# EAGLE design Xbee_Adapter (EAGLE 7.6.0)
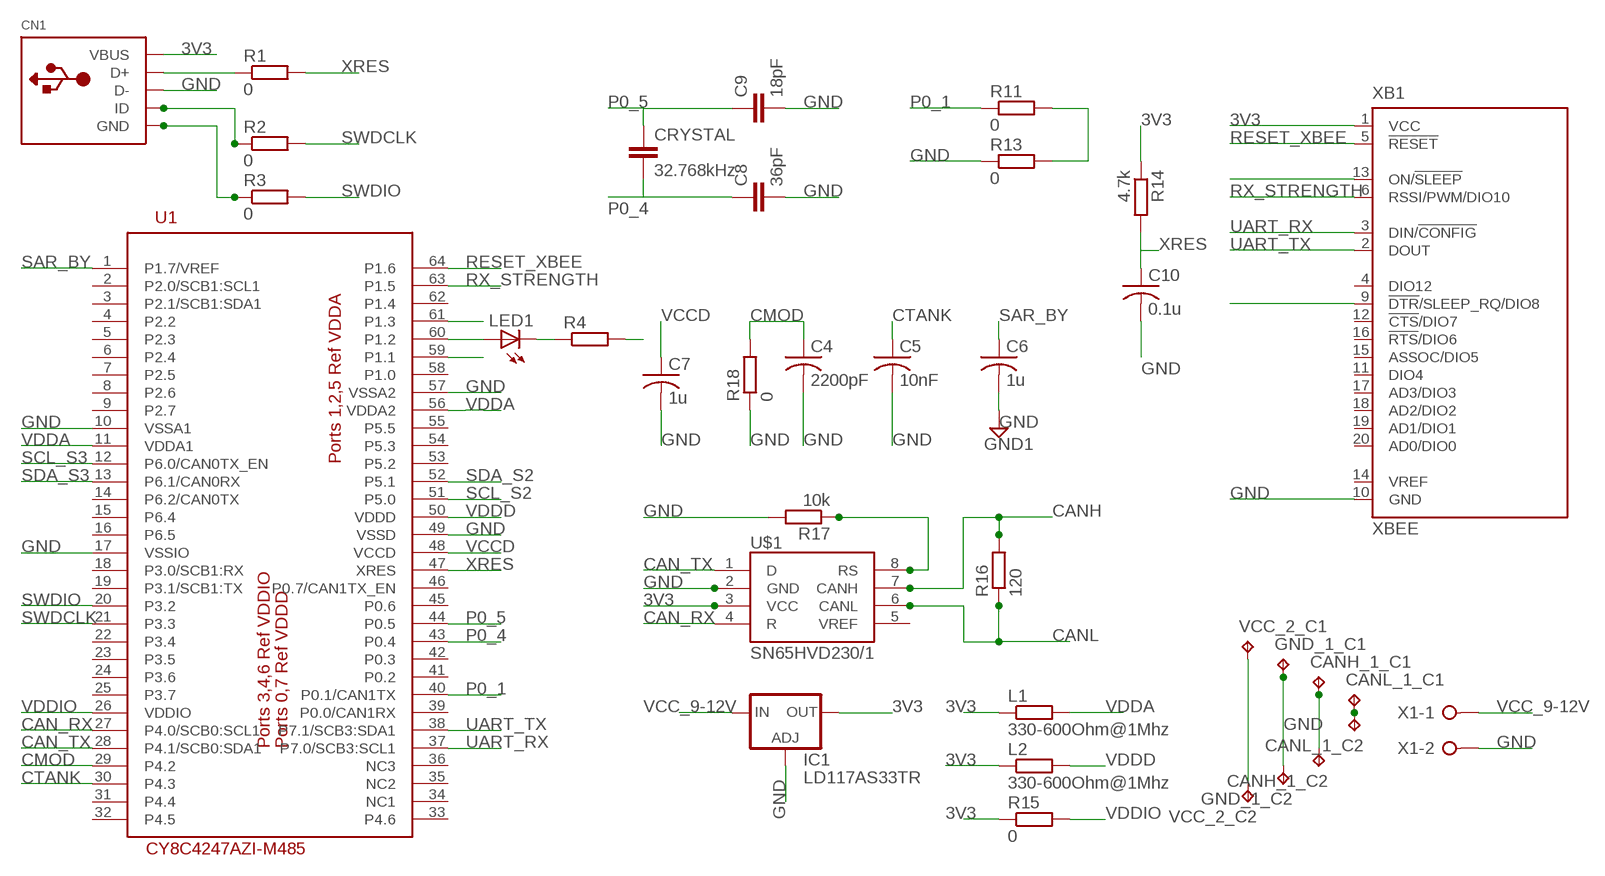
[diagram p0: schematic, sheet 1]

## Parts
C4  2200pF  C-USC0805  [C0805]
C5  10nF  C-USC0805  [C0805]
C6  1u  C-USC0805  [C0805]
C7  1u  C-USC0805  [C0805]
C8  36pF  C-EUC0805  [C0805]
C9  18pF  C-EUC0805  [C0805]
C10  0.1u  C-USC0805  [C0805]
CANH_1_C1  TPB2,54  [B2,54]
CANH_1_C2  TPB2,54  [B2,54]
CANL_1_C1  TPB2,54  [B2,54]
CANL_1_C2  TPB2,54  [B2,54]
CN1  USBMINIB  [USB-MINIB]
CRYSTAL  32.768kHz  C-EUC0603  [C0603]
GND_1_C1  TPB2,54  [B2,54]
GND_1_C2  TPB2,54  [B2,54]
IC1  LD117AS33TR  [SOT223]
L1  330-600Ohm@1Mhz  R-EU_R0805  [R0805]
L2  330-600Ohm@1Mhz  R-EU_R0805  [R0805]
LED1  LEDCHIP-LED0805  [CHIP-LED0805]
R1  0  R-EU_R0805  [R0805]
R2  0  R-EU_R0805  [R0805]
R3  0  R-EU_R0805  [R0805]
R4  R-EU_R0805  [R0805]
R11  0  R-EU_R0805  [R0805]
R13  0  R-EU_R0805  [R0805]
R14  4.7k  R-EU_R0805  [R0805]
R15  0  R-EU_R0805  [R0805]
R16  120  R-EU_R0805  [R0805]
R17  10k  R-EU_R0805  [R0805]
R18  0  R-EU_R0805  [R0805]
U1  CY8C4247AZI-M485  [TQFP64-10X10]
U$1  SN65HVD230/1  [SO8]
VCC_2_C1  TPB2,54  [B2,54]
VCC_2_C2  TPB2,54  [B2,54]
X1  W237-02P  [W237-132]
XB1  XBEE  [XBEE]

## Nets
3V3: CN1.VBUS IC1.4(OUT) L1.1 L2.1 R14.1 R15.1 U$1.3(VCC) XB1.1(VCC)
CAN_RX: U1.27(P4.0/SCB0:SCL1) U$1.4(R)
CAN_TX: U1.28(P4.1/SCB0:SDA1) U$1.1(D)
CANH: CANH_1_C1.TP CANH_1_C2.TP R16.2 U$1.7(CANH)
CANL: CANL_1_C1.TP CANL_1_C2.TP R16.1 U$1.6(CANL)
CMOD: C4.1 R18.2 U1.29(P4.2)
CTANK: C5.1 U1.30(P4.3)
GND: C4.2 C5.2 C6.2 C7.2 C8.2 C9.2 C10.2 CN1.D- GND_1_C1.TP GND_1_C2.TP IC1.1(ADJ) R4.2 R13.1 R17.2 R18.1 U1.10(VSSA1) U1.17(VSSIO) U1.49(VSSD) U1.57(VSSA2) U$1.2(GND) X1.2 XB1.10(GND) ; supply symbol labelled GND1
N$1: CN1.D+ R1.1
N$2: CN1.ID R2.1
N$3: CN1.GND R3.1
N$4: R11.2 R13.2
N$5: LED1.A U1.60(P1.2)
N$6: LED1.C R4.1
N$9: R17.1 U$1.8(RS)
P0_1: R11.1 U1.40(P0.1/CAN1TX)
P0_4: C8.1 CRYSTAL.2 U1.43(P0.4)
P0_5: C9.1 CRYSTAL.1 U1.44(P0.5)
RESET_XBEE: U1.64(P1.6) XB1.5(!RESET)
RX_STRENGTH: U1.63(P1.5) XB1.6(RSSI/PWM/DIO10)
SAR_BY: C6.1 U1.1(P1.7/VREF)
SCL_S2: U1.51(P5.0)
SCL_S3: U1.12(P6.0/CAN0TX_EN)
SDA_S2: U1.52(P5.1)
SDA_S3: U1.13(P6.1/CAN0RX)
SLEEP_CTRL: U1.61(P1.3) XB1.9(!DTR!/SLEEP_RQ/DIO8)
SLEEP_XBEE: U1.59(P1.1) XB1.13(ON/!SLEEP)
SWDCLK: R2.2 U1.21(P3.3)
SWDIO: R3.2 U1.20(P3.2)
UART_RX: U1.37(P7.0/SCB3:SCL1) XB1.3(DIN/!CONFIG)
UART_TX: U1.38(P7.1/SCB3:SDA1) XB1.2(DOUT)
VCC_9-12V: IC1.3(IN) VCC_2_C1.TP VCC_2_C2.TP X1.1
VCCD: C7.1 U1.48(VCCD)
VDDA: L1.2 U1.11(VDDA1) U1.56(VDDA2)
VDDD: L2.2 U1.50(VDDD)
VDDIO: R15.2 U1.26(VDDIO)
XRES: C10.1 R1.2 R14.2 U1.47(XRES)
Unconnected: U1.2(P2.0/SCB1:SCL1) U1.3(P2.1/SCB1:SDA1) U1.4(P2.2) U1.5(P2.3) U1.6(P2.4) U1.7(P2.5) U1.8(P2.6) U1.9(P2.7) U1.14(P6.2/CAN0TX) U1.15(P6.4) U1.16(P6.5) U1.18(P3.0/SCB1:RX) U1.19(P3.1/SCB1:TX) U1.22(P3.4) U1.23(P3.5) U1.24(P3.6) U1.25(P3.7) U1.31(P4.4) U1.32(P4.5) U1.33(P4.6) U1.34(NC1) U1.35(NC2) U1.36(NC3) U1.39(P0.0/CAN1RX) U1.41(P0.2) U1.42(P0.3) U1.45(P0.6) U1.46(P0.7/CAN1TX_EN) U1.53(P5.2) U1.54(P5.3) U1.55(P5.5) U1.58(P1.0) U1.62(P1.4) U$1.5(VREF) XB1.4(DIO12) XB1.11(DIO4) XB1.12(!CTS!/DIO7) XB1.14(VREF) XB1.15(ASSOC/DIO5) XB1.16(!RTS!/DIO6) XB1.17(AD3/DIO3) XB1.18(AD2/DIO2) XB1.19(AD1/DIO1) XB1.20(AD0/DIO0)

## Library data of the parts
C4-C7 C10 = rcl:C-US: CAPACITOR, American symbol
C8 C9 CRYSTAL = rcl:C-EU: CAPACITOR, European symbol
CANH_1_C1 CANH_1_C2 CANL_1_C1 CANL_1_C2 GND_1_C1 GND_1_C2 VCC_2_C1 VCC_2_C2 = testpad:TP: Test pad
CN1 = adafruit:USB: USB Connectors USBMINIB - Surface Mount Female Mini-B USB Connector 4UConnector: 06564 By microbuilder.eu Thru-hole RA Female Mini-B USB Connector 4UConnector: 18732 By ladyada.net
IC1 = v-reg:LD117A?*: Low drop fixed and adjustable positive voltage regulators 1 A Source: http://www.st.com/stonline/products/literature/ds/7194/ld1117axx.pdf
L1 L2 R1-R4 R11 R13-R18 = rcl:R-EU_: RESISTOR, European symbol
LED1 = adafruit:LED: LED OSRAM: - CHIPLED LG R971, LG N971, LY N971, LG Q971, LY Q971, LO R971, LY R971 LH N974, LH R974 LS Q976, LO Q976, LY Q976 LO Q996 - Hyper CHIPLED LW Q18S LB Q993, LB Q99A, LB R99A - SideLED LS A670, LO A670, LY A670, LG A670, LP A670 LB A673, LV A673, LT A673, LW A673 LH A674 LY A675 LS A676, LA A676, LO A676, LY A676, LW A676 LS A679, LY A679, LG A679 - Hyper Micro SIDELED® LS Y876, LA Y876, LO Y876, LY Y876 LT Y87S - SmartLED LW L88C, LW L88S LB L89C, LB L89S, LG L890 LS L89K, LO L89K, LY L89K LS L896, LA L896, LO L896, LY L896 - TOPLED LS T670, LO T670, LY T670, LG T670, LP T670 LSG T670, LSP T670, LSY T670, LOP T670, LYG T670 LG T671, LOG T671, LSG T671 LB T673, LV T673, LT T673, LW T673 LH T674 LS T676, LA T676, LO T676, LY T676, LB T676, LH T676, LSB T676, LW T676 LB T67C, LV T67C, LT T67C, LS T67K, LO T67K, LY T67K, LW E67C LS E67B, LA E67B, LO E67B, LY E67B, LB E67C, LV E67C, LT E67C LW T67C LS T679, LY T679, LG T679 LS T770, LO T770, LY T770, LG T770, LP T770 LB T773, LV T773, LT T773, LW T773 LH T774 LS E675, LA E675, LY E675, LS T675 LS T776, LA T776, LO T776, LY T776, LB T776 LHGB T686 LT T68C, LB T68C - Hyper Mini TOPLED® LB M676 - Mini TOPLED Santana® LG M470 LS M47K, LO M47K, LY M47K Source: http://www.osram.convergy.de/
U1 = CypressPSoC:CY8C4247AZI-M485
U$1 = texas_instruments:SN65HVD230/1
X1 = con-wago-508:W237-02P: WAGO SREW CLAMP; OC_FARNELL: unknown; OC_NEWARK: unknown
XB1 = xbee:XBEE: XBee (TM) /XBee-PRO(TM) OEM RF Modules Source: MaxStream, Inc. xbee_productmanual.pdf; MPN: XBP24-Z7UIT-004; OC_FARNELL: 1751799; OC_NEWARK: 34R5507

## Board
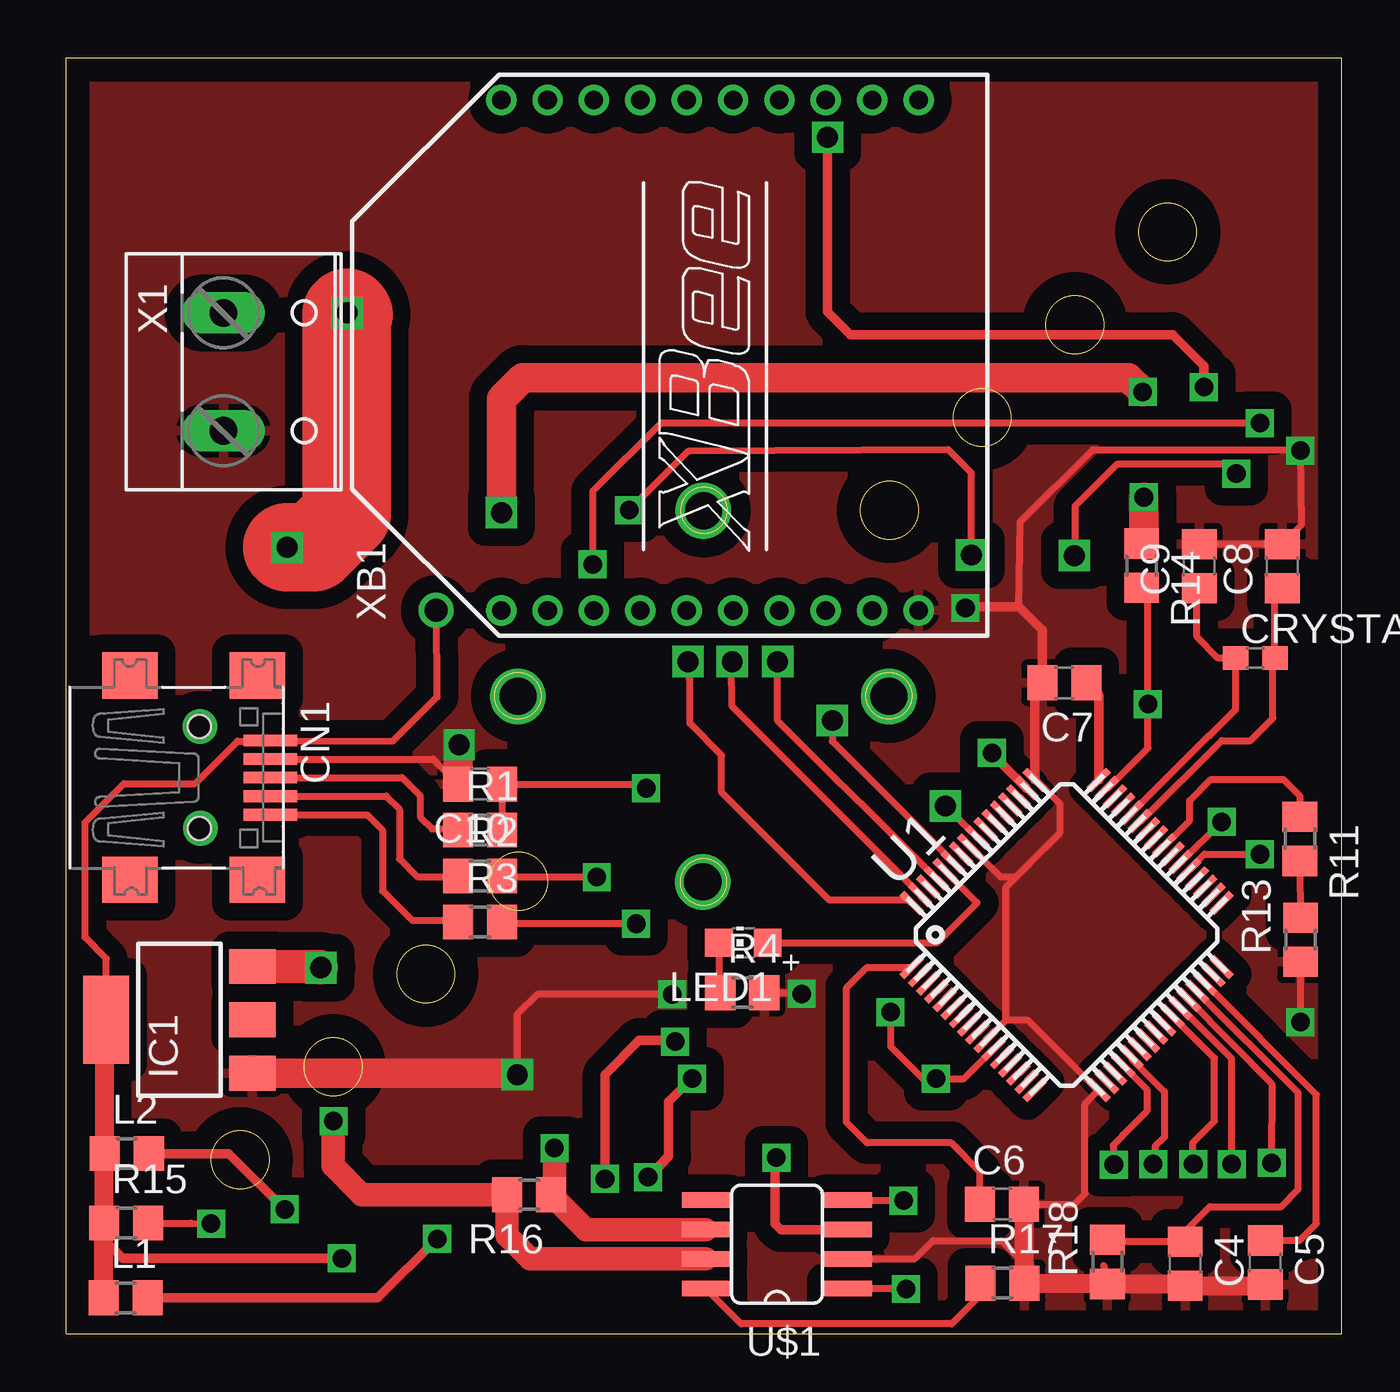
[diagram p1: board, top side]
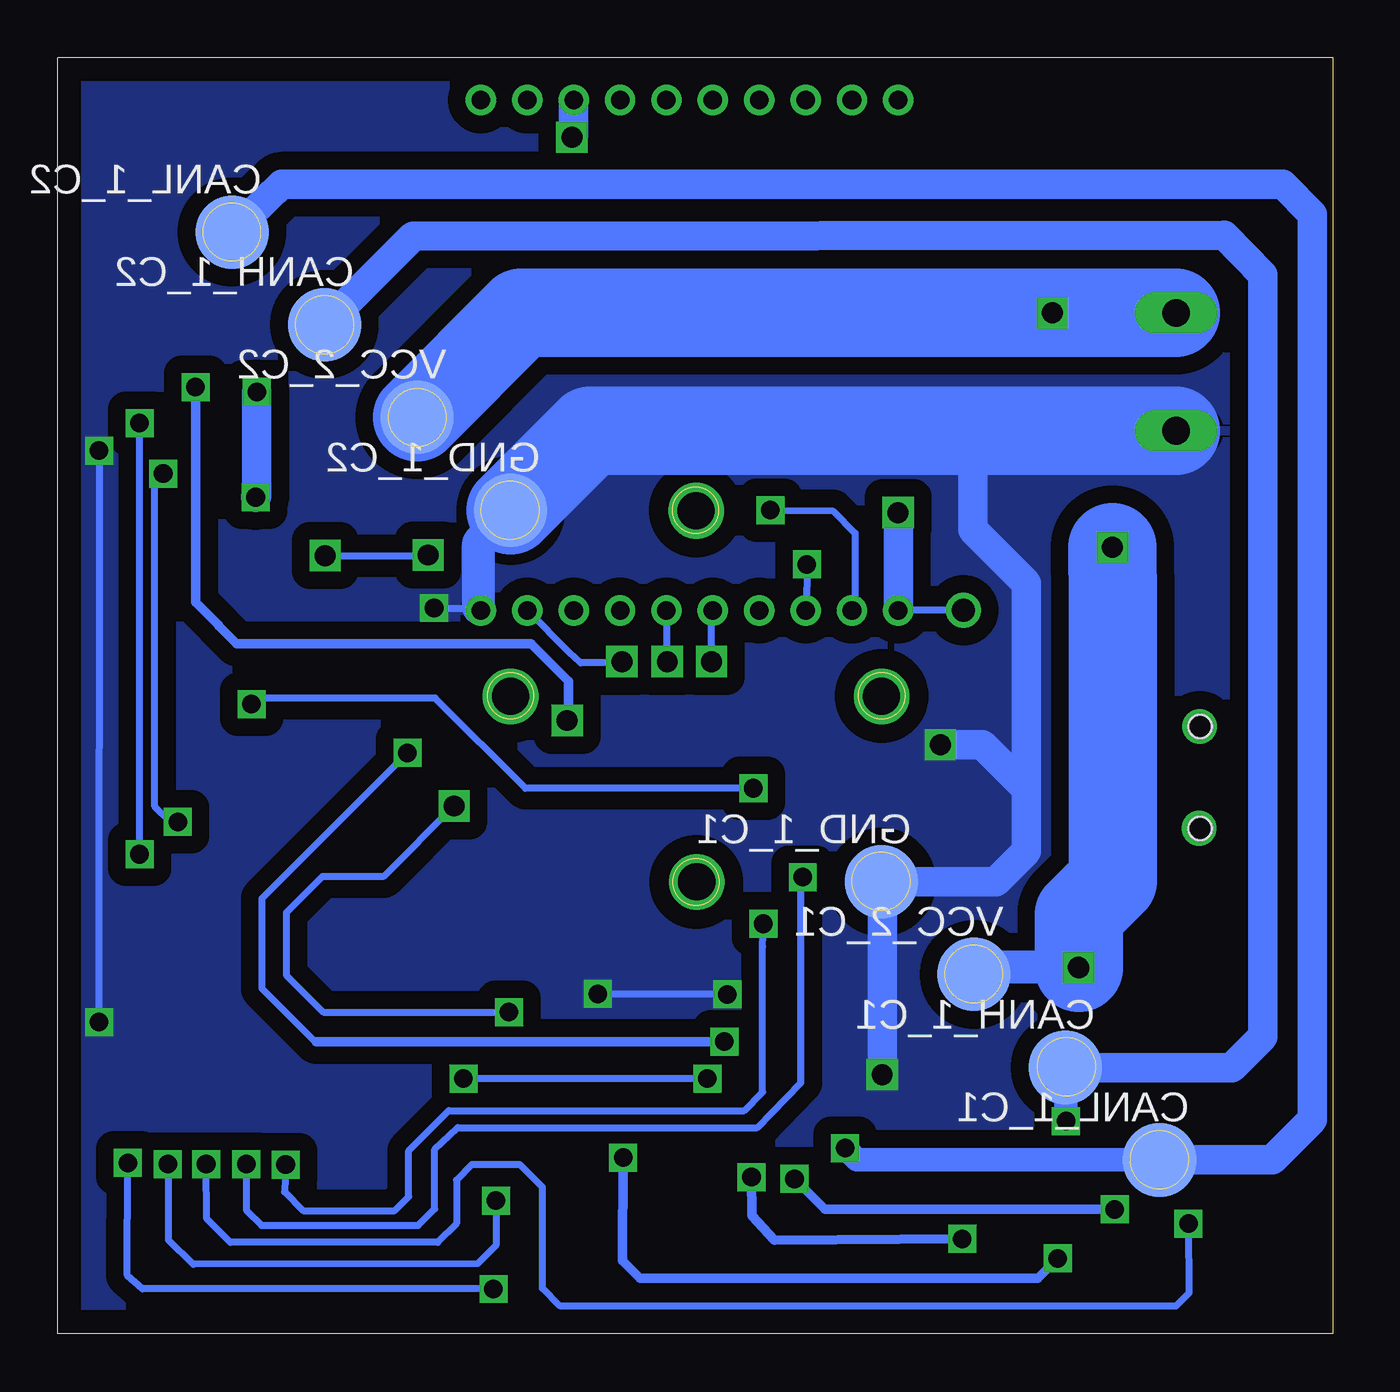
[diagram p2: board, bottom side, seen from below]

Size 55 x 55 mm. Coordinates in mm from the lower left corner, seen from the top.
Outline: 0,0 0,55 55,55 55,0 0,0
Outline: circle at 27.47,19.47 radius 1
Outline: circle at 19.47,27.5 radius 1
Outline: circle at 35.47,27.5 radius 1
Outline: circle at 43.5,43.5 radius 1.25
Outline: circle at 47.5,47.5 radius 1.25
Outline: circle at 43.5,43.5 radius 1.25
Outline: circle at 39.5,39.5 radius 1.25
Outline: circle at 35.5,35.5 radius 1.25
Outline: circle at 15.5,15.5 radius 1.25
Outline: circle at 11.5,11.5 radius 1.25
Outline: circle at 47.5,47.5 radius 1.25
Outline: circle at 39.5,39.5 radius 1.25
Outline: circle at 19.5,19.5 radius 1.25
Outline: circle at 7.5,7.5 radius 1.25
Outline: circle at 19.5,19.5 radius 1.25
Outline: circle at 15.5,15.5 radius 1.25
Outline: circle at 11.5,11.5 radius 1.25
Outline: circle at 35.5,35.5 radius 1.25
Outline: circle at 27.5,35.5 radius 1
Outline: circle at 7.5,7.5 radius 1.25
Copper layers (1*16): Top 0.035mm / dielectric 1.5mm / Bottom 0.035mm
Design rules "default": minimum track width 10mil, minimum drill 24mil, track to track 8mil, track to pad 8mil, pad to pad 8mil, via to via 8mil, smd to smd 8mil, copper to edge 40mil, drill to drill 8mil, minimum pad ring 10mil, minimum via ring 8mil, stop-mask expansion 4mil, vias tented up to drill 0mil, thermal gap 10mil

### Footprints (pad centres in the part's own frame; a part is rotated, then mirrored left to right if it is on the bottom)
C0805 = smd 1.3 x 1.5: 1 -0.95,0; 2 0.95,0
B2,54 = smd 3.175 x 3.175 bottom: P$1 0,0 | smd 2.54 x 2.54 bottom: TP 0,0
USB-MINIB = smd 0.5 x 2.308: D+ 0,4.064; D- -0.8,4.064; GND 1.6,4.064; ID 0.8,4.064; VBUS -1.6,4.064 | smd 2 x 2.4: GND1 -4.4,-2; GND2 -4.4,3.5; GND3 4.4,3.5; GND4 4.4,-2 | hole 1: -2.2,1; 2.2,1
C0603 = smd 1.1 x 1: 1 -0.85,0; 2 0.85,0
SOT223 = smd 1.5 x 2: 1 -2.3,-3.15; 2 0,-3.15; 3 2.3,-3.15 | smd 3.8 x 2: 4 0,3.15
R0805 = smd 1.3 x 1.5: 1 -0.95,0; 2 0.95,0
CHIP-LED0805 = smd 1.2 x 1.2: A 0,-1.05; C 0,1.05
TQFP64-10X10 = smd 1.2 x 0.3: 1 -5.7,3.75; 2 -5.7,3.25; 3 -5.7,2.75; 4 -5.7,2.25; 5 -5.7,1.75; 6 -5.7,1.25; 7 -5.7,0.75; 8 -5.7,0.25; 9 -5.7,-0.25; 10 -5.7,-0.75; 11 -5.7,-1.25; 12 -5.7,-1.75; 13 -5.7,-2.25; 14 -5.7,-2.75; 15 -5.7,-3.25; 16 -5.7,-3.75; 33 5.7,-3.75; 34 5.7,-3.25; 35 5.7,-2.75; 36 5.7,-2.25; 37 5.7,-1.75; 38 5.7,-1.25; 39 5.7,-0.75; 40 5.7,-0.25; 41 5.7,0.25; 42 5.7,0.75; 43 5.7,1.25; 44 5.7,1.75; 45 5.7,2.25; 46 5.7,2.75; 47 5.7,3.25; 48 5.7,3.75 | smd 0.3 x 1.2: 17 -3.75,-5.7; 18 -3.25,-5.7; 19 -2.75,-5.7; 20 -2.25,-5.7; 21 -1.75,-5.7; 22 -1.25,-5.7; 23 -0.75,-5.7; 24 -0.25,-5.7; 25 0.25,-5.7; 26 0.75,-5.7; 27 1.25,-5.7; 28 1.75,-5.7; 29 2.25,-5.7; 30 2.75,-5.7; 31 3.25,-5.7; 32 3.75,-5.7; 49 3.75,5.7; 50 3.25,5.7; 51 2.75,5.7; 52 2.25,5.7; 53 1.75,5.7; 54 1.25,5.7; 55 0.75,5.7; 56 0.25,5.7; 57 -0.25,5.7; 58 -0.75,5.7; 59 -1.25,5.7; 60 -1.75,5.7; 61 -2.25,5.7; 62 -2.75,5.7; 63 -3.25,5.7; 64 -3.75,5.7
SO8 = smd 0.66 x 2.032: 1 -1.905,-3.073; 2 -0.635,-3.073; 3 0.635,-3.073; 4 1.905,-3.073; 5 1.905,3.073; 6 0.635,3.073; 7 -0.635,3.073; 8 -1.905,3.073
W237-132 = drill 1.194 long: 1 -2.54,-0.635; 2 2.54,-0.635
XBEE = drill 0.8 pad 1.27: 1 -11,9; 2 -11,7; 3 -11,5; 4 -11,3; 5 -11,1; 6 -11,-1; 7 -11,-3; 8 -11,-5; 9 -11,-7; 10 -11,-9; 11 11,-9; 12 11,-7; 13 11,-5; 14 11,-3; 15 11,-1; 16 11,1; 17 11,3; 18 11,5; 19 11,7; 20 11,9

### Placement (x,y rotation side)
C4  48.25,3.01 270 top
C5  51.71,3.07 270 top
C6  40.35,5.58 0 top
C7  43.04,28.06 180 top
C8  52.44,33.09 90 top
C9  48.86,33.09 90 top
C10  17.85,23.69 180 top
CANH_1_C1  11.55,11.47 0 top
CANH_1_C2  43.5,43.5 0 top
CANL_1_C1  7.48,7.48 0 top
CANL_1_C2  47.49,47.49 0 top
CN1  4.74,23.97 270 top
CRYSTAL  51.27,29.13 0 top
GND_1_C1  19.47,19.47 0 top
GND_1_C2  35.48,35.5 0 top
IC1  4.87,13.53 90 top
L1  2.56,1.54 0 top
L2  2.61,7.76 0 top
LED1  29.2,16.86 90 top
R1  17.85,21.71 0 top
R2  17.85,19.73 0 top
R3  17.85,17.75 0 top
R4  29.15,14.7 0 top
R11  53.2,21.33 270 top
R13  53.23,16.98 90 top
R14  46.37,33.11 270 top
R15  2.58,4.77 0 top
R16  19.96,5.99 180 top
R17  40.38,2.18 0 top
R18  44.9,3.09 90 top
U1  43.15,17.19 45 top
U$1  30.65,3.85 90 top
VCC_2_C1  15.49,15.49 0 top
VCC_2_C2  39.51,39.51 0 top
X1  7.41,41.47 270 top
XB1  27.75,42.18 90 top

### Tracks (layer width: path | path; a pad name or v marks a point on that pad's centre or on a via)
3V3  (via drill 0.8, 0.9, 1)
  Top 0.305: IC1.4 1.72,16.17 0.8,17.09 0.8,22.04 2.48,23.72 5.55,23.72 7.38,25.54 8.78,25.54 CN1.VBUS 14.06,25.54 15.99,27.45 15.97,31.16 v15.94,31.18
  Top 0.406: U$1.3 30.83,4.49 30.57,4.74 30.57,7.71 v30.62,7.59 | v11.88,3.24 2.42,3.24 1.61,4.06
  Top 0.813: L1.1 1.61,4.06 1.61,4.74 R15.1 1.63,7.74 L2.1 1.66,13.47 IC1.4
  Top 1.27: v18.76,35.4 18.76,40.3 19.68,41.22 45.81,41.22 v46.42,40.61 | v46.47,36.06 46.47,34.16 R14.1
  Bottom 0.305: v15.94,31.18 XB1.1
  Bottom 0.406: v30.62,7.59 30.65,3.14 29.89,2.38 12.74,2.38 v11.88,3.24
  Bottom 1.27: XB1.1 18.75,35.39 v18.76,35.4 | v46.42,40.61 46.42,36.11 v46.47,36.06
CAN_RX  (via drill 0.8)
  Top 0.305: U$1.4 36.09,5.76 v36.11,5.73 | v50.26,7.31 50.26,11.84 U1.27
  Bottom 0.305: v36.11,5.73 36.11,3.8 36.9,3.01 49.17,2.99 50.23,4.03 50.23,7.28 v50.26,7.31
CAN_TX  (via drill 0.8)
  Top 0.305: U$1.1 36.19,1.95 v36.21,1.92 | v51.99,7.36 52.01,10.75 U1.28
  Bottom 0.305: v36.21,1.92 51.35,1.92 52.01,2.51 v51.99,7.36
CANH  (via drill 0.8)
  Top 1.016: U$1.7 20.01,3.22 19.02,4.21 19.02,5.98 R16.2 12.74,5.99 11.5,7.23 11.5,9.14 v11.52,9.16
  Bottom 1.016: v11.52,9.16 11.52,11.45 CANH_1_C1.TP
  Bottom 1.27: CANH_1_C1.TP 4.36,11.47 3.04,12.79 3.04,45.66 4.69,47.36 39.69,47.31 CANH_1_C2.TP
CANL  (via drill 0.8)
  Top 1.016: U$1.6 22.4,4.49 21.05,5.84 | 21.05,5.84 R16.1 | v21.05,7.99 21.05,5.84
  Bottom 1.016: CANL_1_C1.TP 20.54,7.48 v21.05,7.99
  Bottom 1.27: CANL_1_C1.TP 2.63,7.48 0.91,9.21 0.91,48.25 2.18,49.55 45.36,49.55 CANL_1_C2.TP
CMOD
  Top 0.305: R18.2 44.98,3.96 C4.1 48.25,4.41 49.32,5.48 52.39,5.48 53.13,6.21 53.13,10.39 U1.29 48.81,14.75
CTANK
  Top 0.305: C5.1 53.19,4.02 53.92,4.74 53.92,10.31 U1.30
GND  (via drill 0.8, 0.9)
  Top 0.305: 44.75,2.93 R18.1 | U$1.2 36.59,3.22 37.38,4 40.34,4 41.33,3.01 | CN1.D- 15.82,24.77 C10.2 | C9.2 C8.2 53.26,34.85 v53.23,38.07 53.15,38.12 44.26,38.12 41.14,34.99 41.09,31.34 | R13.1 v53.23,13.43 | 38.8,31.26 v38.78,31.28 | C6.2 43.48,5.58 43.93,6.04 43.93,9.91 U1.17 44.47,10.51 41.47,13.5 40.52,13.5 | 40.52,13.5 U1.10 | U1.49 41.82,23.87 42.84,22.85 42.84,21.58 41.52,20.26 41.52,20.24 40.96,19.68 | 40.96,19.68 40.3,19.68 U1.57 | 40.52,13.5 40.52,19.24 40.96,19.68 | R4.2 31.67,14.7 v31.72,14.65 | v26.13,14.62 20.31,14.62 19.45,13.76 v19.45,11.17
  Top 0.406: v38.78,31.28 38.83,31.34 41.09,31.34 42.09,30.33 C7.2 41.77,27.73 U1.49
  Top 0.813: C6.2 41.33,5.55 41.33,3.01 R17.2 44.86,2.18 R18.1 48.18,2.14 C4.2 51.6,2.06 C5.2
  Top 1.27: IC1.1 19.39,11.23 v19.45,11.17 | C10.2 16.9,25.36 v16.93,25.39
  Bottom 0.305: v53.23,13.43 53.2,37 v53.23,38.07 | v38.78,31.28 36.86,31.28 XB1.10 | v31.72,14.65 26.15,14.65 v26.13,14.62
  Bottom 1.27: 13.23,23.49 13.23,20.79 14.55,19.47 GND_1_C1.TP 19.45,19.45 v19.45,11.17 | 13.23,23.49 13.23,32.35 15.54,34.66 15.54,37.53 16.93,38.93 | v16.93,25.39 15.13,25.39 13.23,23.49
  Bottom 1.422: 36.86,31.28 36.86,34.12 GND_1_C2.TP
  Bottom 3.81: X1.2 16.93,38.93 32.05,38.93 GND_1_C2.TP
  pour Bottom (isolate 0.762): -0.54,54.96 -0.24,24.4 -0.62,10.23 -0.59,10.33 -0.59,-0.24 54.65,-0.34 54.65,54.8 3.14,54.91
  pour Top (isolate 0.762): -0.62,54.7 -0.21,24.48 -0.36,24.53 -0.59,10.2 -0.62,10.23 -0.54,-0.36 54.65,-0.29 54.65,54.7
N$1
  Top 0.305: CN1.D+ 14.47,23.97 15.26,23.18 15.26,22.27 15.77,21.76 16.85,21.76 R1.1
N$2
  Top 0.305: CN1.ID 13.8,23.17 14.37,22.6 14.37,20.46 15.13,19.7 16.87,19.7 R2.1
N$3
  Top 0.305: CN1.GND 12.97,22.37 13.63,21.71 13.63,19.09 14.9,17.82 16.82,17.82 R3.1
N$4
  Top 0.305: R11.2 53.2,20.12 R13.2
N$5
  Top 0.305: LED1.A 37.56,16.86 39.29,18.58 39.27,18.58 U1.60
N$6
  Top 0.305: LED1.C 28.15,14.75 R4.1
N$7  (via drill 1)
  other vias: 5.76,26.18
N$8  (via drill 1)
  other vias: 5.78,21.79
N$9
  Top 0.305: R17.1 39.43,1.66 38.19,0.42 29.1,0.42 U$1.8
N$23  (via drill 1.6)
  other vias: 35.48,27.47
N$24  (via drill 1.6)
  other vias: 27.47,35.48
N$25  (via drill 1.6)
  other vias: 19.47,27.47
N$28  (via drill 1.6)
  other vias: 27.45,19.47
P0_1
  Top 0.305: U1.40 47.38,21.04 48.45,22.12 48.45,22.98 49.37,23.89 52.49,23.89 53.2,23.18 R11.1
P0_4
  Top 0.305: C8.1 52.12,31.82 CRYSTAL.2 52.04,29.04 52.04,26.53 51.07,25.57 49.83,25.57 46.36,22.1 U1.43
P0_5
  Top 0.305: C9.1 48.76,32.04 48.76,30.04 49.67,29.13 CRYSTAL.1 50.44,29.11 50.44,26.92 49.32,25.8 49.29,25.8 45.95,22.46 U1.44
RESET_XBEE  (via drill 0.9)
  Top 0.305: U1.64 36.28,18.69 32.9,18.69 28.26,23.33 28.26,24.93 26.89,26.31 26.89,28.9 v26.81,28.97 26.89,28.08
  Bottom 0.305: v26.81,28.97 26.81,31.12 XB1.5
RX_STRENGTH  (via drill 0.9)
  Top 0.305: U1.63 36.82,18.94 28.72,27.04 28.69,28.85 v28.72,28.97
  Bottom 0.305: v28.72,28.97 28.74,31.17 XB1.6
SAR_BY
  Top 0.305: C6.1 39.4,6.99 38.17,8.22 34.54,8.22 33.65,9.11 33.65,14.9 34.54,15.79 36.45,15.79 U1.1
SLEEP_CTRL  (via drill 0.9)
  Top 0.305: U1.61 37.51,19.63 34.61,22.52 33.11,23.99 30.67,26.43 v30.67,28.97
  Bottom 0.305: v30.67,28.97 30.73,28.92 32.45,28.92 32.93,29.35 XB1.9
SLEEP_XBEE  (via drill 0.8, 0.9)
  Top 0.305: v33.04,26.43 33.04,25.53 U1.59
  Top 0.406: v32.83,51.58 32.83,44.06 33.82,43.07 47.72,43.07 49.06,41.72 v49.06,40.81
  Bottom 0.406: v49.06,40.81 49.06,31.54 48.07,30.55 48.07,30.52 47.29,29.74 34.59,29.74 32.99,28.13 32.99,26.05 v33.04,26.43
  Bottom 1.27: XB1.13 32.75,51.66 v32.83,51.58
SWDCLK  (via drill 0.8)
  Top 0.305: U1.21 45.94,11.85 47.36,10.43 47.36,8.48 46.96,8.07 46.96,7.48 v46.88,7.31 | v22.88,19.68 18.85,19.68 R2.2
  Bottom 0.305: v46.88,7.31 46.88,5.33 46.22,4.67 39.46,4.67 38.75,5.38 38.75,7.94 37.76,8.88 24.83,8.88 22.95,10.81 22.95,19.22 v22.88,19.68
SWDIO  (via drill 0.8)
  Top 0.305: U1.20 45.59,11.55 46.6,10.53 46.6,9.59 45.56,8.55 45.48,8.45 45.15,8.12 45.18,7.43 v45.18,7.28 | v24.58,17.67 18.87,17.67 R3.2
  Bottom 0.305: v45.18,7.28 45.23,6.11 44.42,5.3 40.48,5.3 39.87,5.91 39.87,7.89 38.14,9.62 25.39,9.62 24.6,10.41 24.6,16.68 v24.58,17.67
UART_RX  (via drill 0.8)
  Top 0.305: U1.37 49.09,20.67 v51.48,20.67 | v51.48,39.26 25.65,39.26 22.7,36.31 v22.7,33.16 22.7,33.04
  Bottom 0.305: v51.48,20.67 v51.48,39.26 | v22.7,33.16 22.72,31.21 XB1.3
UART_TX  (via drill 0.8, 0.9)
  Top 0.305: U1.38 48.1,20.33 v49.83,22.06 | v50.46,37.08 50.06,37.48 45.31,37.48 43.5,35.68 43.5,33.57 v43.48,33.55 | v39.03,33.57 39.03,37.13 38.04,38.12 26.81,38.04 v24.27,35.5
  Bottom 0.305: v49.83,22.06 50.16,22.06 50.82,22.72 50.82,36.72 v50.46,37.08 | v43.48,33.55 39.06,33.55 v39.03,33.57 | v24.27,35.5 21.58,35.48 20.62,34.51 20.62,31.34 XB1.2
VCC_9-12V  (via drill 0.9)
  Top 1.422: v10.99,15.79 10.95,15.83 IC1.3 10.9,15.83 v10.96,15.77
  Top 3.81: 12.18,43.93 v12.11,44.01 12.08,43.98 12.08,35.32 10.66,33.9 v9.52,33.9
  Bottom 1.422: v10.99,15.79 14.37,15.79 15.23,14.93 15.23,15.23 VCC_2_C1.TP
  Bottom 3.81: VCC_2_C2.TP 35.02,44.01 v12.11,44.01 X1.1 | v10.96,15.77 10.96,18.05 9.49,19.52 9.49,31.56 v9.52,33.9
VCCD
  Top 0.406: U1.48 44.53,27.53 C7.1
VDDA  (via drill 0.8, 0.9)
  Top 0.305: U1.56 39.27,21.39 v37.91,22.75 | v35.55,13.86 35.55,12.39 36.97,10.96 v37.51,10.99 38.72,10.99 U1.11
  Top 0.406: L1.2 13.43,1.54 v15.99,4.08 | v25.09,6.75 25.19,6.82 25.98,7.64 25.98,10 v26.99,10.99
  Bottom 0.305: v37.91,22.75 40.96,19.7 43.6,19.7 45.15,18.15 45.15,15.46 43.55,13.86 v35.55,13.86 | v26.99,10.99 v37.51,10.99
  Bottom 0.406: v15.99,4.08 24.1,4.03 25.06,5.07 v25.09,6.75
VDDD  (via drill 0.8)
  Top 0.406: L2.2 7,7.76 v9.42,5.35 | v23.23,6.67 23.23,11.17 24.71,12.64 26.2,12.64 v26.26,12.59 | v39.92,25.04 39.92,25.01 U1.50
  Bottom 0.305: 43.86,12.59 43.91,12.59 46.19,14.88 46.19,18.76 v39.92,25.04
  Bottom 0.406: v9.42,5.35 21.91,5.35 v23.23,6.67 | v26.26,12.59 43.86,12.59
VDDIO  (via drill 0.8)
  Top 0.305: R15.2 5.38,4.77 v6.24,4.74 | v48.61,7.31 48.58,8.22 49.52,9.16 49.52,11.87 U1.26
  Bottom 0.305: v48.61,7.31 48.58,4.94 47.57,3.93 38.63,3.93 37.81,4.74 37.81,6.62 37.15,7.28 35.07,7.28 34.1,6.32 34.1,1.95 33.34,1.19 6.77,1.19 6.21,1.74 v6.24,4.74
XRES  (via drill 0.8)
  Top 0.305: R1.2 C10.1 24.83,23.69 v25.01,23.51 | R14.2 46.65,31.88 v46.65,27.14 46.65,25.24 44.93,23.52 U1.47
  Bottom 0.305: v25.01,23.51 34.84,23.51 38.73,27.4 46.4,27.4 v46.65,27.14